# EAGLE schematic ethernet-relay-temp_v1.2 (EAGLE 9.2.2)
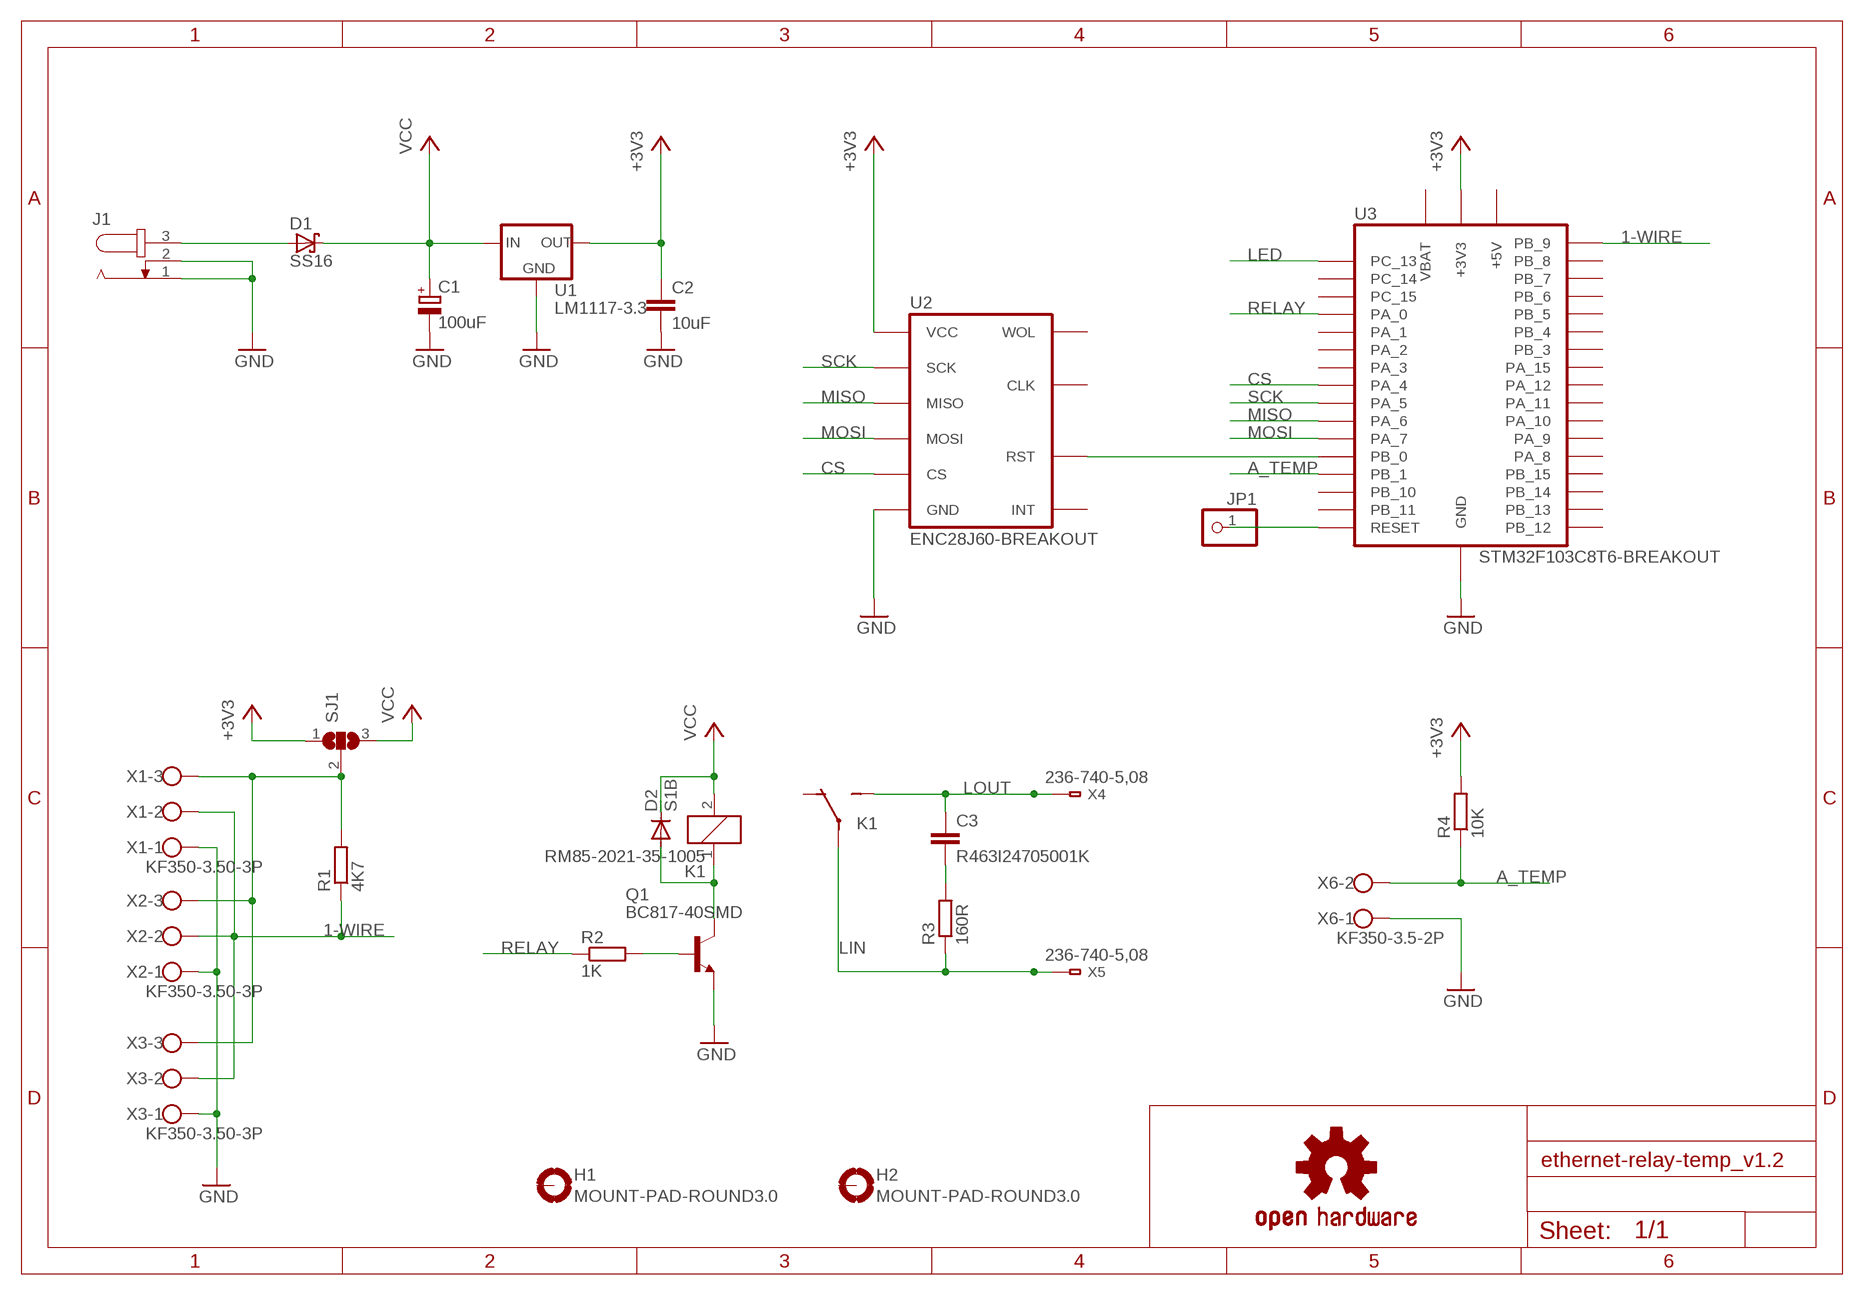
[diagram p0: schematic, sheet 1]

## Parts
C1  100uF  CPOL-EUE2-5  [E2-5]
C2  10uF  C-EUC0805  [C0805]
C3  R463I24705001K  C-EU150-084X183  [C150-084X183]
D1  SS16  [DO214AC]
D2  S1B  [DO214AC]
H1  MOUNT-PAD-ROUND3.0  [3,0-PAD]
H2  MOUNT-PAD-ROUND3.0  [3,0-PAD]
J1  JACK-PLUG0  [SPC4077]
JP1  PINHD-1X1  [1X01]
K1  RM85-2021-35-1005  [RM85]
LOGO1  OSHW-LOGOS-COPPER  [OSHW-LOGO-S_COPPER]
Q1  BC817-40SMD  [SOT23-BEC]
R1  4K7  R-EU_R0805  [R0805]
R2  1K  R-EU_R0805  [R0805]
R3  160R  R-EU_R2010  [R2010]
R4  10K  R-EU_R0805  [R0805]
SJ1  SJ2W  [SJ_2]
U1  LM1117-3.3  [SOT223]
U2  ENC28J60-BREAKOUT  [ENC28J60]
U3  STM32F103C8T6-BREAKOUT  [STM32F103C8T6]
X1  KF350-3.50-3P  [KF350-3.50-3P]
X2  KF350-3.50-3P  [KF350-3.50-3P]
X3  KF350-3.50-3P  [KF350-3.50-3P]
X4  236-740-5,08  [236-4XX]
X5  236-740-5,08  [236-4XX]
X6  KF350-3.5-2P  [KF350-3.50-2P]

## Nets
1-WIRE: R1.1 U3.PB_9 X1.2 X2.2 X3.2
+3V3: C2.1 R4.2 SJ1.1 U1.2(OUT) U1.4(OUT) U2.VCC U3.+3V3 U3.+3V3@1(+3V3)
A_TEMP: R4.1 U3.PB_1 X6.2
CS: U2.CS U3.PA_4
GND: C1.- C2.2 J1.1 J1.2 Q1.E U1.1(GND) U2.GND U3.GND U3.GND@1(GND) U3.GND@2(GND) X1.1 X2.1 X3.1 X6.1
LED: U3.PC_13
LIN [220V]: K1.11(P) K1.21(P) R3.1 X5.1@1(A1) X5.1@2(B1)
LOUT: C3.1 K1.14(NO) K1.24(NO) X4.1@1(A1) X4.1@2(B1)
MISO: U2.SO(MISO) U3.PA_6
MOSI: U2.SI(MOSI) U3.PA_7
N$1: JP1.1 U3.RESET
N$2: U2.RST U3.PB_0
N$3: C3.2 R3.2
N$5: D2.A K1.1 Q1.C
N$7: Q1.B R2.2
N$8: R1.2 SJ1.2 X1.3 X2.3 X3.3
N$9: D1.A J1.3
RELAY: R2.1 U3.PA_0
SCK: U2.SCK U3.PA_5
VCC: C1.+ D1.C D2.C K1.2 SJ1.3 U1.3(IN)
Unconnected: H1.B3,0(MOUNT) H2.B3,0(MOUNT) K1.12(NC) K1.22(NC) U2.CLK U2.NT(INT) U2.WOL U3.PA_1 U3.PA_2 U3.PA_3 U3.PA_8 U3.PA_9 U3.PA_10 U3.PA_11 U3.PA_12 U3.PA_15 U3.PB_3 U3.PB_4 U3.PB_5 U3.PB_6 U3.PB_7 U3.PB_8 U3.PB_10 U3.PB_11 U3.PB_12 U3.PB_13 U3.PB_14 U3.PB_15 U3.PC_14 U3.PC_15

## Power pins joined to a net without a drawn wire
+5V: U3.+5V
VBAT: U3.VBAT

## Library data of the parts
C1 = rcl:CPOL-EU: POLARIZED CAPACITOR, European symbol; SPICEPREFIX: C
C2 C3 = rcl:C-EU: CAPACITOR, European symbol; SPICEPREFIX: C
D1 = my-diode:SS?*: Schottky Barrier Rectifier; A: 1; V: 60
D2 = my-diode:S?*: Rectifier Diode; V: 70
H1 H2 = holes:MOUNT-PAD-ROUND: MOUNTING PAD, round
J1 = con-jack:JACK-PLUG: DC POWER JACK Power Jack, DC, Right Angle, Through Hole, Rated 5A at 16VDC, PC Terminals Distributor: Farnell (www.Farnell.de) Drawing: 84N1161.pdf / 84N1162.pdf Manufacturer: SPC Technology (www.spctechnology.com) Type: SPC4077 / SPC 4078; OC_FARNELL: unknown; OC_NEWARK: unknown
JP1 = pinhead:PINHD-1X1: PIN HEADER
K1 = my-relay:RM85-20?-35-*
LOGO1 = SparkFun-Aesthetics:OSHW-LOGO: Open-Source Hardware (OSHW) Logo This logo indicates the piece of hardware it is found on incorporates a OSHW license and/or adheres to the definition of open source hardware found here: http://freedomdefined.org/OSHW
Q1 = transistor-npn:BC817*: NPN Transistor
R1-R4 = rcl:R-EU_: RESISTOR, European symbol; SPICEPREFIX: R
SJ1 = jumper:SJ2W: SMD solder JUMPER
U1 = my-power:LM1117-*: LDO regulator
U2 = my-modules:ENC28J60-BREAKOUT: SPI Ethernet module
U3 = my-modules:STM32F103C8T6-BREAKOUT: 32bit ARM processor breakout board
X1-X3 = my-connectors:KF350-3.50-3P: Screw terminal 3.5mm pitch
X4 X5 = con-wago:236: Anreihbare Einzelklemme 2,5 mm² 16A Rastermaß 5/5,08 | 7,5/7,62 | 10/10,16
X6 = my-connectors:KF350-3.5-2P: Screw terminal 3.5mm pitch

## Net classes
1 220V: width 1.8 mm, clearance 0.2 mm